# EAGLE design POE Injector (EAGLE 6.5.0)
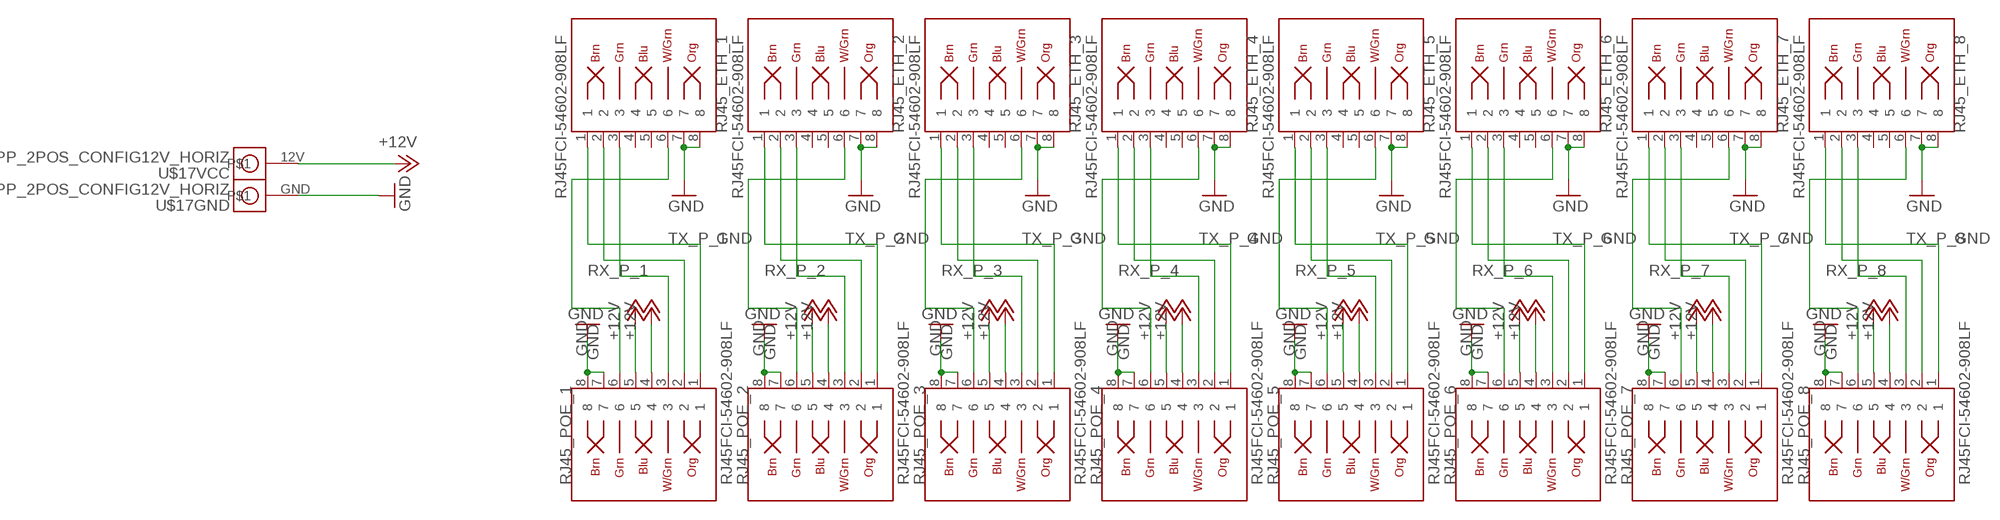
[diagram p0: schematic, sheet 1]

## Parts
RJ45_ETH_1  RJ45FCI-54602-908LF  [FCI-54602-908LF]
RJ45_ETH_2  RJ45FCI-54602-908LF  [FCI-54602-908LF]
RJ45_ETH_3  RJ45FCI-54602-908LF  [FCI-54602-908LF]
RJ45_ETH_4  RJ45FCI-54602-908LF  [FCI-54602-908LF]
RJ45_ETH_5  RJ45FCI-54602-908LF  [FCI-54602-908LF]
RJ45_ETH_6  RJ45FCI-54602-908LF  [FCI-54602-908LF]
RJ45_ETH_7  RJ45FCI-54602-908LF  [FCI-54602-908LF]
RJ45_ETH_8  RJ45FCI-54602-908LF  [FCI-54602-908LF]
RJ45_POE_1  RJ45FCI-54602-908LF  [FCI-54602-908LF]
RJ45_POE_2  RJ45FCI-54602-908LF  [FCI-54602-908LF]
RJ45_POE_3  RJ45FCI-54602-908LF  [FCI-54602-908LF]
RJ45_POE_4  RJ45FCI-54602-908LF  [FCI-54602-908LF]
RJ45_POE_5  RJ45FCI-54602-908LF  [FCI-54602-908LF]
RJ45_POE_6  RJ45FCI-54602-908LF  [FCI-54602-908LF]
RJ45_POE_7  RJ45FCI-54602-908LF  [FCI-54602-908LF]
RJ45_POE_8  RJ45FCI-54602-908LF  [FCI-54602-908LF]
U$17  APP_2POS_CONFIG12V_HORIZ  [APP45_12V_HORIZ_CONFIG]

## Nets
+12V: RJ45_POE_1.4 RJ45_POE_1.5 RJ45_POE_2.4 RJ45_POE_2.5 RJ45_POE_3.4 RJ45_POE_3.5 RJ45_POE_4.4 RJ45_POE_4.5 RJ45_POE_5.4 RJ45_POE_5.5 RJ45_POE_6.4 RJ45_POE_6.5 RJ45_POE_7.4 RJ45_POE_7.5 RJ45_POE_8.4 RJ45_POE_8.5 U$17.12V
GND: RJ45_ETH_1.7 RJ45_ETH_1.8 RJ45_ETH_2.7 RJ45_ETH_2.8 RJ45_ETH_3.7 RJ45_ETH_3.8 RJ45_ETH_4.7 RJ45_ETH_4.8 RJ45_ETH_5.7 RJ45_ETH_5.8 RJ45_ETH_6.7 RJ45_ETH_6.8 RJ45_ETH_7.7 RJ45_ETH_7.8 RJ45_ETH_8.7 RJ45_ETH_8.8 RJ45_POE_1.7 RJ45_POE_1.8 RJ45_POE_2.7 RJ45_POE_2.8 RJ45_POE_3.7 RJ45_POE_3.8 RJ45_POE_4.7 RJ45_POE_4.8 RJ45_POE_5.7 RJ45_POE_5.8 RJ45_POE_6.7 RJ45_POE_6.8 RJ45_POE_7.7 RJ45_POE_7.8 RJ45_POE_8.7 RJ45_POE_8.8 U$17.GND
RX_N_1: RJ45_ETH_1.6 RJ45_POE_1.6
RX_N_2: RJ45_ETH_2.6 RJ45_POE_2.6
RX_N_3: RJ45_ETH_3.6 RJ45_POE_3.6
RX_N_4: RJ45_ETH_4.6 RJ45_POE_4.6
RX_N_5: RJ45_ETH_5.6 RJ45_POE_5.6
RX_N_6: RJ45_ETH_6.6 RJ45_POE_6.6
RX_N_7: RJ45_ETH_7.6 RJ45_POE_7.6
RX_N_8: RJ45_ETH_8.6 RJ45_POE_8.6
RX_P_1: RJ45_ETH_1.3 RJ45_POE_1.3
RX_P_2: RJ45_ETH_2.3 RJ45_POE_2.3
RX_P_3: RJ45_ETH_3.3 RJ45_POE_3.3
RX_P_4: RJ45_ETH_4.3 RJ45_POE_4.3
RX_P_5: RJ45_ETH_5.3 RJ45_POE_5.3
RX_P_6: RJ45_ETH_6.3 RJ45_POE_6.3
RX_P_7: RJ45_ETH_7.3 RJ45_POE_7.3
RX_P_8: RJ45_ETH_8.3 RJ45_POE_8.3
TX_N_1: RJ45_ETH_1.2 RJ45_POE_1.2
TX_N_2: RJ45_ETH_2.2 RJ45_POE_2.2
TX_N_3: RJ45_ETH_3.2 RJ45_POE_3.2
TX_N_4: RJ45_ETH_4.2 RJ45_POE_4.2
TX_N_5: RJ45_ETH_5.2 RJ45_POE_5.2
TX_N_6: RJ45_ETH_6.2 RJ45_POE_6.2
TX_N_7: RJ45_ETH_7.2 RJ45_POE_7.2
TX_N_8: RJ45_ETH_8.2 RJ45_POE_8.2
TX_P_1: RJ45_ETH_1.1 RJ45_POE_1.1
TX_P_2: RJ45_ETH_2.1 RJ45_POE_2.1
TX_P_3: RJ45_ETH_3.1 RJ45_POE_3.1
TX_P_4: RJ45_ETH_4.1 RJ45_POE_4.1
TX_P_5: RJ45_ETH_5.1 RJ45_POE_5.1
TX_P_6: RJ45_ETH_6.1 RJ45_POE_6.1
TX_P_7: RJ45_ETH_7.1 RJ45_POE_7.1
TX_P_8: RJ45_ETH_8.1 RJ45_POE_8.1
Unconnected: RJ45_ETH_1.4 RJ45_ETH_1.5 RJ45_ETH_2.4 RJ45_ETH_2.5 RJ45_ETH_3.4 RJ45_ETH_3.5 RJ45_ETH_4.4 RJ45_ETH_4.5 RJ45_ETH_5.4 RJ45_ETH_5.5 RJ45_ETH_6.4 RJ45_ETH_6.5 RJ45_ETH_7.4 RJ45_ETH_7.5 RJ45_ETH_8.4 RJ45_ETH_8.5

## Library data of the parts
RJ45_ETH_1-RJ45_ETH_8 RJ45_POE_1-RJ45_POE_8 = MRDT-2015-General:RJ45
U$17 = MRDT-Connectors:APP_2POS_CONFIG; COLOR1: YELLOW; COLOR2: BLACK

## Board
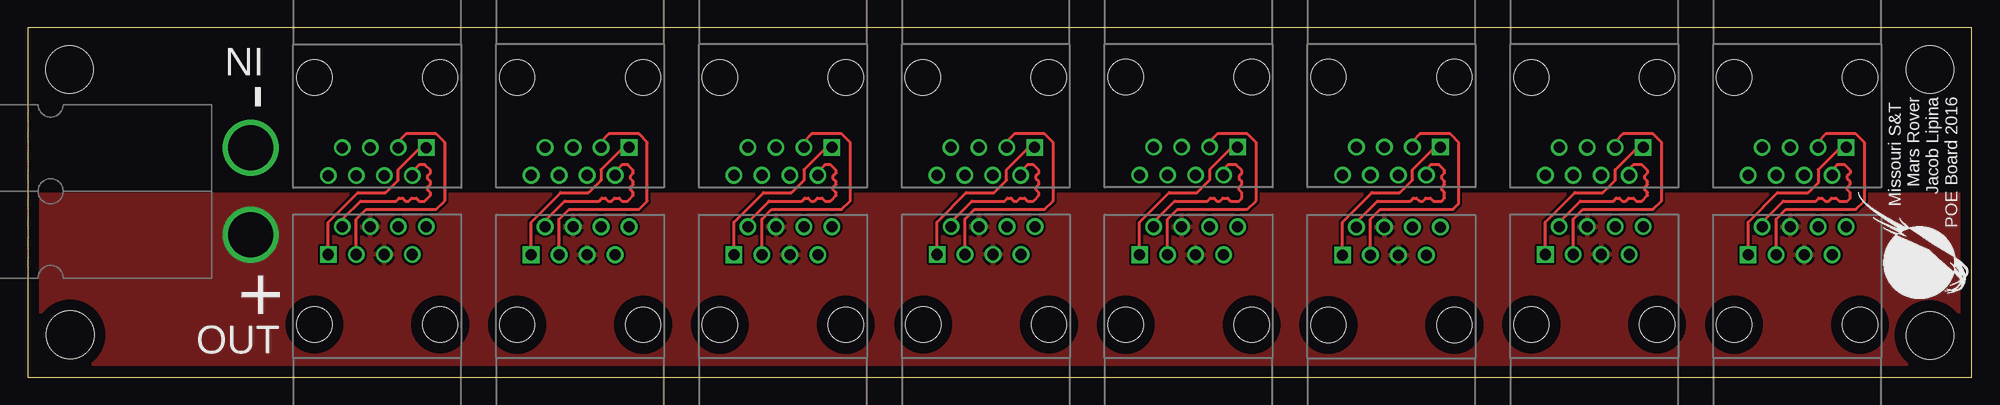
[diagram p1: board, top side]
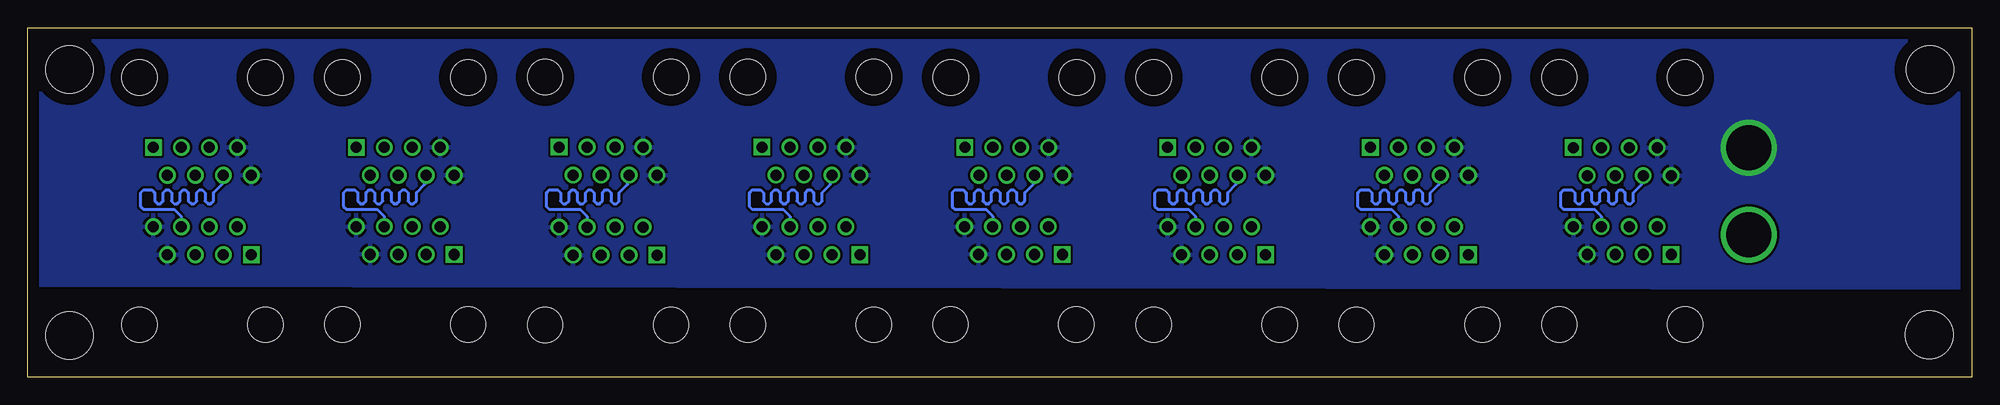
[diagram p2: board, bottom side, seen from below]

Size 176.53 x 31.75 mm. Coordinates in mm from the lower left corner, seen from the top.
Outline: 0,0 176.53,0 176.53,31.75 0,31.75 0,0
Copper layers (1*16): Top 0.035mm / dielectric 1.5mm / Bottom 0.035mm
Design rules "default": minimum track width 10mil, minimum drill 24mil, track to track 8mil, track to pad 8mil, pad to pad 8mil, via to via 8mil, smd to smd 8mil, copper to edge 40mil, drill to drill 8mil, minimum pad ring 10mil, minimum via ring 8mil, stop-mask expansion 4mil, vias tented up to drill 0mil, thermal gap 10mil
Holes 4.32 mm at 3.87,3.87 3.81,27.94 172.72,27.94 172.72,3.81

### Footprints (pad centres in the part's own frame; a part is rotated, then mirrored left to right if it is on the bottom)
FCI-54602-908LF = drill 1 square: 1 -4.445,6.35 | drill 1: 2 -3.175,8.89; 3 -1.905,6.35; 4 -0.635,8.89; 5 0.635,6.35; 6 1.905,8.89; 7 3.175,6.35; 8 4.445,8.89 | hole 3.2: -5.715,0; 5.715,0
APP45_12V_HORIZ_CONFIG = drill 4.064: 12V 28.194,3.937; GND 28.194,11.811

### Placement (x,y rotation side)
RJ45_ETH_1  31.75,27.2 180 top
RJ45_ETH_2  50.16,27.23 180 top
RJ45_ETH_3  68.58,27.23 180 top
RJ45_ETH_4  87,27.23 180 top
RJ45_ETH_5  105.41,27.25 180 top
RJ45_ETH_6  123.83,27.25 180 top
RJ45_ETH_7  142.24,27.23 180 top
RJ45_ETH_8  160.66,27.23 180 top
RJ45_POE_1  31.75,4.8 0 top
RJ45_POE_2  50.16,4.78 0 top
RJ45_POE_3  68.58,4.78 0 top
RJ45_POE_4  87.02,4.8 0 top
RJ45_POE_5  105.41,4.78 0 top
RJ45_POE_6  123.83,4.75 0 top
RJ45_POE_7  142.24,4.8 0 top
RJ45_POE_8  160.66,4.78 0 top
U$1  [MRDT_LOGO]  177.04,7.11 90 top
U$17  -7.94,9.02 0 top

### Tracks (layer width: path | path; a pad name or v marks a point on that pad's centre or on a via)
+12V
  pour Top: -0.03,16.56 176.56,16.59 176.5,-1.28 -0.08,-1.23
GND
  pour Bottom: -0.25,32.26 176.53,32.51 176.53,8.38 -0.25,8.13
RX_N_1
  Bottom 0.254: RJ45_POE_1.6 33.66,14.61 34.29,15.24 37.08,15.24 37.34,15.49 37.34,16.76 37.08,17.02 36.32,17.02 36.07,16.76 36.07,16 35.81,15.75 35.56,15.75 35.31,16 35.31,16.76 35.05,17.02 34.8,17.02 34.54,16.76 34.54,16 34.29,15.75 34.04,15.75 33.78,16 33.78,16.76 33.53,17.02 33.27,17.02 33.02,16.76 33.02,16 32.77,15.75 32.51,15.75 32.26,16 32.26,16.76 32,17.02 31.75,17.02 31.5,16.76 31.5,16 31.24,15.75 30.99,15.75 30.73,16 30.73,16.76 29.97,17.53 29.97,18.2 RJ45_ETH_1.6
RX_N_2
  Bottom 0.254: RJ45_POE_2.6 52.07,14.61 52.7,15.24 55.5,15.24 55.75,15.49 55.75,16.76 55.5,17.02 54.74,17.02 54.48,16.76 54.48,16 54.23,15.75 53.98,15.75 53.72,16 53.72,16.76 53.47,17.02 53.21,17.02 52.96,16.76 52.96,16 52.7,15.75 52.45,15.75 52.2,16 52.2,16.76 51.94,17.02 51.69,17.02 51.44,16.76 51.44,16 51.18,15.75 50.93,15.75 50.67,16 50.67,16.76 50.42,17.02 50.16,17.02 49.91,16.76 49.91,16 49.66,15.75 49.4,15.75 49.15,16 49.15,16.76 48.39,17.53 48.39,18.2 RJ45_ETH_2.6
RX_N_3
  Bottom 0.254: RJ45_POE_3.6 70.48,14.61 71.12,15.24 73.91,15.24 74.17,15.49 74.17,16.76 73.91,17.02 73.15,17.02 72.9,16.76 72.9,16 72.64,15.75 72.39,15.75 72.14,16 72.14,16.76 71.88,17.02 71.63,17.02 71.37,16.76 71.37,16 71.12,15.75 70.87,15.75 70.61,16 70.61,16.76 70.36,17.02 70.1,17.02 69.85,16.76 69.85,16 69.6,15.75 69.34,15.75 69.09,16 69.09,16.76 68.83,17.02 68.58,17.02 68.33,16.76 68.33,16 68.07,15.75 67.82,15.75 67.56,16 67.56,16.76 66.8,17.53 66.8,18.2 RJ45_ETH_3.6
RX_N_4
  Bottom 0.254: RJ45_POE_4.6 88.9,14.61 89.53,15.24 92.33,15.24 92.58,15.49 92.58,16.76 92.33,17.02 91.57,17.02 91.31,16.76 91.31,16 91.06,15.75 90.81,15.75 90.55,16 90.55,16.76 90.3,17.02 90.04,17.02 89.79,16.76 89.79,16 89.53,15.75 89.28,15.75 89.03,16 89.03,16.76 88.77,17.02 88.52,17.02 88.27,16.76 88.27,16 88.01,15.75 87.76,15.75 87.5,16 87.5,16.76 87.25,17.02 87,17.02 86.74,16.76 86.74,16 86.49,15.75 86.23,15.75 85.98,16 85.98,16.76 85.22,17.53 85.22,18.2 RJ45_ETH_4.6
RX_N_5
  Bottom 0.254: RJ45_POE_5.6 107.31,14.61 107.95,15.24 110.74,15.24 111,15.49 111,16.76 110.74,17.02 109.98,17.02 109.73,16.76 109.73,16 109.47,15.75 109.22,15.75 108.97,16 108.97,16.76 108.71,17.02 108.46,17.02 108.2,16.76 108.2,16 107.95,15.75 107.7,15.75 107.44,16 107.44,16.76 107.19,17.02 106.93,17.02 106.68,16.76 106.68,16 106.43,15.75 106.17,15.75 105.92,16 105.92,16.76 105.66,17.02 105.41,17.02 105.16,16.76 105.16,16 104.9,15.75 104.65,15.75 104.39,16 104.39,16.76 103.63,17.53 103.63,18.2 RJ45_ETH_5.6
RX_N_6
  Bottom 0.254: RJ45_POE_6.6 125.73,14.61 126.36,15.24 129.16,15.24 129.41,15.49 129.41,16.76 129.16,17.02 128.4,17.02 128.14,16.76 128.14,16 127.89,15.75 127.64,15.75 127.38,16 127.38,16.76 127.13,17.02 126.87,17.02 126.62,16.76 126.62,16 126.36,15.75 126.11,15.75 125.86,16 125.86,16.76 125.6,17.02 125.35,17.02 125.09,16.76 125.09,16 124.84,15.75 124.59,15.75 124.33,16 124.33,16.76 124.08,17.02 123.83,17.02 123.57,16.76 123.57,16 123.32,15.75 123.06,15.75 122.81,16 122.81,16.76 122.05,17.53 122.05,18.2 RJ45_ETH_6.6
RX_N_7
  Bottom 0.254: RJ45_POE_7.6 144.15,14.61 144.78,15.24 147.57,15.24 147.83,15.49 147.83,16.76 147.57,17.02 146.81,17.02 146.56,16.76 146.56,16 146.3,15.75 146.05,15.75 145.8,16 145.8,16.76 145.54,17.02 145.29,17.02 145.03,16.76 145.03,16 144.78,15.75 144.53,15.75 144.27,16 144.27,16.76 144.02,17.02 143.76,17.02 143.51,16.76 143.51,16 143.26,15.75 143,15.75 142.75,16 142.75,16.76 142.49,17.02 142.24,17.02 141.99,16.76 141.99,16 141.73,15.75 141.48,15.75 141.22,16 141.22,16.76 140.46,17.53 140.46,18.2 RJ45_ETH_7.6
RX_N_8
  Bottom 0.254: RJ45_POE_8.6 162.56,14.61 163.19,15.24 165.99,15.24 166.24,15.49 166.24,16.76 165.99,17.02 165.23,17.02 164.97,16.76 164.97,16 164.72,15.75 164.47,15.75 164.21,16 164.21,16.76 163.96,17.02 163.7,17.02 163.45,16.76 163.45,16 163.19,15.75 162.94,15.75 162.69,16 162.69,16.76 162.43,17.02 162.18,17.02 161.93,16.76 161.93,16 161.67,15.75 161.42,15.75 161.16,16 161.16,16.76 160.91,17.02 160.66,17.02 160.4,16.76 160.4,16 160.15,15.75 159.89,15.75 159.64,16 159.64,16.76 158.88,17.53 158.88,18.2 RJ45_ETH_8.6
RX_P_1
  Top 0.254: RJ45_POE_1.3 29.84,14.35 30.73,15.24 37.08,15.24 37.85,16 37.85,21.34 37.08,22.1 34.35,22.1 33.66,21.4 RJ45_ETH_1.3
RX_P_2
  Top 0.254: RJ45_POE_2.3 48.26,14.35 49.15,15.24 55.5,15.24 56.26,16 56.26,21.34 55.5,22.1 52.77,22.1 52.07,21.4 RJ45_ETH_2.3
RX_P_3
  Top 0.254: RJ45_POE_3.3 66.67,14.35 67.56,15.24 73.91,15.24 74.68,16 74.68,21.34 73.91,22.1 71.18,22.1 70.48,21.4 RJ45_ETH_3.3
RX_P_4
  Top 0.254: RJ45_POE_4.3 85.09,14.35 85.98,15.24 92.33,15.24 93.09,16 93.09,21.34 92.33,22.1 89.6,22.1 88.9,21.4 RJ45_ETH_4.3
RX_P_5
  Top 0.254: RJ45_POE_5.3 103.5,14.35 104.39,15.24 110.74,15.24 111.51,16 111.51,21.34 110.74,22.1 108.01,22.1 107.31,21.4 RJ45_ETH_5.3
RX_P_6
  Top 0.254: RJ45_POE_6.3 121.92,14.35 122.81,15.24 129.41,15.24 129.92,15.75 129.92,21.34 129.16,22.1 126.43,22.1 125.73,21.4 RJ45_ETH_6.3
RX_P_7
  Top 0.254: RJ45_POE_7.3 140.34,14.35 141.22,15.24 147.57,15.24 148.34,16 148.34,21.34 147.57,22.1 144.84,22.1 144.15,21.4 RJ45_ETH_7.3
RX_P_8
  Top 0.254: RJ45_POE_8.3 158.75,14.35 159.64,15.24 165.99,15.24 166.75,16 166.75,21.34 165.99,22.1 163.26,22.1 162.56,21.4 RJ45_ETH_8.3
TX_N_1
  Top 0.254: RJ45_ETH_1.2 35.05,18.46 35.05,18.8 35.56,19.3 36.07,19.3 36.58,18.8 36.58,18.54 36.32,18.29 36.32,18.03 36.58,17.78 36.58,17.53 36.32,17.27 36.32,17.02 36.58,16.76 36.58,16.51 36.07,16 35.56,16 35.31,16.26 34.86,16.26 34.61,16 34.29,16 34.04,16.26 33.72,16.26 33.47,16 30.23,16 28.57,14.35 RJ45_POE_1.2
TX_N_2
  Top 0.254: RJ45_ETH_2.2 53.47,18.46 53.47,18.8 53.98,19.3 54.48,19.3 54.99,18.8 54.99,18.54 54.74,18.29 54.74,18.03 54.99,17.78 54.99,17.53 54.74,17.27 54.74,17.02 54.99,16.76 54.99,16.51 54.48,16 53.98,16 53.72,16.26 53.28,16.26 53.02,16 52.7,16 52.45,16.26 52.13,16.26 51.88,16 48.77,16 46.99,14.22 RJ45_POE_2.2
TX_N_3
  Top 0.254: RJ45_POE_3.2 65.41,14.1 67.31,16 70.29,16 70.55,16.26 70.87,16.26 71.12,16 71.44,16 71.69,16.26 72.14,16.26 72.39,16 72.9,16 73.41,16.51 73.41,16.76 73.15,17.02 73.15,17.27 73.41,17.53 73.41,17.78 73.15,18.03 73.15,18.29 73.41,18.54 73.41,18.8 72.9,19.3 72.39,19.3 71.88,18.8 71.88,18.46 RJ45_ETH_3.2
TX_N_4
  Top 0.254: RJ45_POE_4.2 83.82,14.1 85.72,16 88.71,16 88.96,16.26 89.28,16.26 89.53,16 89.85,16 90.11,16.26 90.55,16.26 90.81,16 91.31,16 91.82,16.51 91.82,16.76 91.57,17.02 91.57,17.27 91.82,17.53 91.82,17.78 91.57,18.03 91.57,18.29 91.82,18.54 91.82,18.8 91.31,19.3 90.81,19.3 90.3,18.8 90.3,18.46 RJ45_ETH_4.2
TX_N_5
  Top 0.254: RJ45_POE_5.2 102.23,14.1 104.14,16 107.12,16 107.38,16.26 107.7,16.26 107.95,16 108.27,16 108.52,16.26 108.97,16.26 109.22,16 109.98,16 110.24,16.26 110.24,16.76 109.98,17.02 109.98,17.27 110.24,17.53 110.24,17.78 109.98,18.03 109.98,18.29 110.24,18.54 110.24,18.8 109.73,19.3 108.99,19.3 108.58,18.9 RJ45_ETH_5.2
TX_N_6
  Top 0.254: RJ45_POE_6.2 120.65,14.1 122.56,16 125.54,16 125.79,16.26 126.11,16.26 126.36,16 126.68,16 126.94,16.26 127.38,16.26 127.64,16 128.4,16 128.65,16.26 128.65,16.76 128.4,17.02 128.4,17.27 128.65,17.53 128.65,17.78 128.4,18.03 128.4,18.29 128.65,18.54 128.65,18.8 128.14,19.3 127.41,19.3 127,18.9 RJ45_ETH_6.2
TX_N_7
  Top 0.254: RJ45_POE_7.2 139.06,14.1 140.97,16 143.95,16 144.21,16.26 144.53,16.26 144.78,16 145.1,16 145.35,16.26 145.8,16.26 146.05,16 146.56,16 147.07,16.51 147.07,16.76 146.81,17.02 146.81,17.27 147.07,17.53 147.07,17.78 146.81,18.03 146.81,18.29 147.07,18.54 147.07,18.8 146.56,19.3 145.8,19.3 145.41,18.92 RJ45_ETH_7.2
TX_N_8
  Top 0.254: RJ45_POE_8.2 157.48,14.1 159.38,16 162.37,16 162.62,16.26 162.94,16.26 163.19,16 163.51,16 163.77,16.26 164.21,16.26 164.47,16 165.23,16 165.48,16.26 165.48,16.76 165.23,17.02 165.23,17.27 165.48,17.53 165.48,17.78 165.23,18.03 165.23,18.29 165.48,18.54 165.48,18.8 164.97,19.3 164.29,19.3 163.83,18.85 RJ45_ETH_8.2
TX_P_1
  Top 0.254: RJ45_POE_1.1 27.3,14.1 29.97,16.76 32.51,16.76 33.66,17.91 33.66,18.86 35.56,20.77 36.09,20.77 RJ45_ETH_1.1
TX_P_2
  Top 0.254: RJ45_POE_2.1 45.72,14.1 48.39,16.76 50.93,16.76 52.07,17.91 52.07,18.86 53.98,20.77 54.5,20.77 RJ45_ETH_2.1
TX_P_3
  Top 0.254: RJ45_POE_3.1 64.14,14.1 66.8,16.76 69.34,16.76 70.48,17.91 70.48,18.86 72.39,20.77 72.92,20.77 RJ45_ETH_3.1
TX_P_4
  Top 0.254: RJ45_POE_4.1 82.55,14.1 85.22,16.76 87.76,16.76 88.9,17.91 88.9,18.86 90.81,20.77 91.33,20.77 RJ45_ETH_4.1
TX_P_5
  Top 0.254: RJ45_POE_5.1 100.97,14.1 103.63,16.76 106.17,16.76 107.31,17.91 107.31,18.86 109.22,20.77 109.75,20.77 RJ45_ETH_5.1
TX_P_6
  Top 0.254: RJ45_POE_6.1 119.38,14.1 122.05,16.76 124.59,16.76 125.73,17.91 125.73,18.86 127.64,20.77 128.16,20.77 RJ45_ETH_6.1
TX_P_7
  Top 0.254: RJ45_POE_7.1 137.79,14.1 140.46,16.76 143,16.76 144.15,17.91 144.15,18.86 146.05,20.77 146.58,20.77 RJ45_ETH_7.1
TX_P_8
  Top 0.254: RJ45_POE_8.1 156.21,14.1 158.88,16.76 161.67,16.76 162.56,17.65 162.56,18.86 164.47,20.77 164.99,20.77 RJ45_ETH_8.1

### Text on the board
tPlace: IN | - | Missouri S&T / Mars Rover / Jacob Lipina / POE Board 2016 | + | OUT